# EAGLE design controlboard (EAGLE 7.5.0)
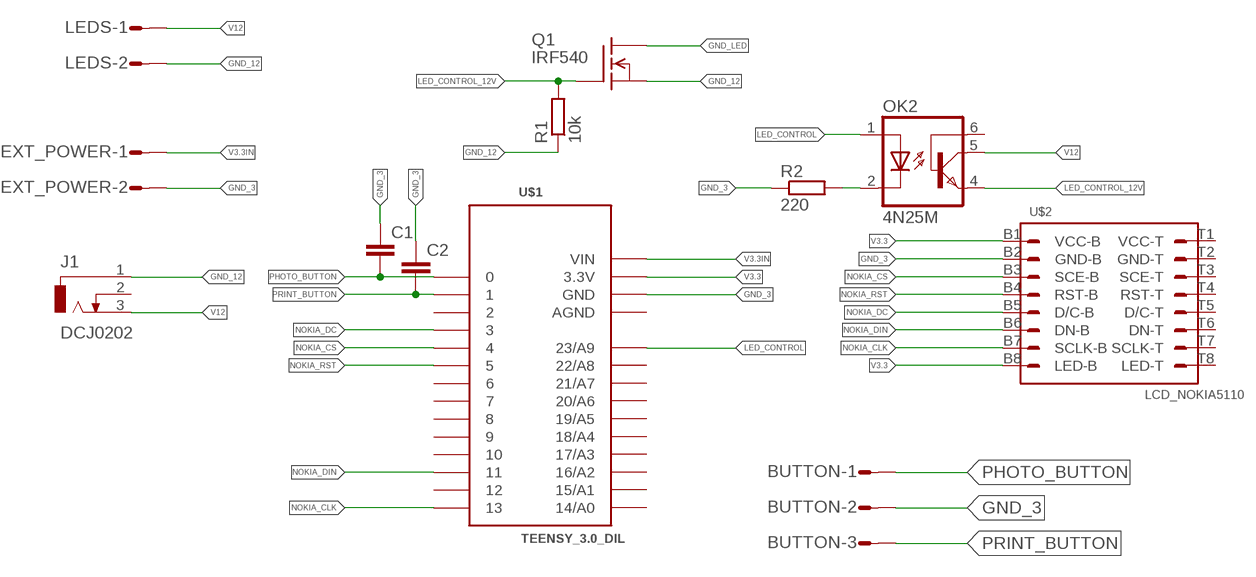
[diagram p0: schematic, sheet 1]

## Parts
BUTTON  L03P  [L03P]
C1  C-EU025-025X050  [C025-025X050]
C2  C-EU025-025X050  [C025-025X050]
EXT_POWER  S02P  [S02P]
J1  DCJ0202  [DCJ0202]
LEDS  L02P  [L02P]
OK2  4N25M  [DIL06]
Q1  IRF540  [TO220]
R1  10k  R-EU_0207/10  [0207/10]
R2  220  R-EU_0207/10  [0207/10]
U$1  TEENSY_3.0_DIL  [TEENSY3-DIL]
U$2  LCD_NOKIA5110  [NOKIA5110]

## Nets
GND_3: BUTTON.2 C1.1 C2.1 EXT_POWER.2 R2.1 U$1.GND U$2.B2(GND-B)
GND_12: J1.1 LEDS.2 Q1.3(S) R1.1
GND_LED: Q1.2(D)
LED_CONTROL: OK2.1(A) U$1.23/A9
LED_CONTROL_12V: OK2.4(EMI) Q1.1(G) R1.2
N$1: OK2.2(C) R2.2
NOKIA_CLK: U$1.13 U$2.B7(SCLK-B)
NOKIA_CS: U$1.4 U$2.B3(SCE-B)
NOKIA_DC: U$1.3 U$2.B5(D/C-B)
NOKIA_DIN: U$1.11 U$2.B6(DN-B)
NOKIA_RST: U$1.5 U$2.B4(RST-B)
PHOTO_BUTTON: BUTTON.1 C1.2 U$1.0
PRINT_BUTTON: BUTTON.3 C2.2 U$1.1
V3.3: U$1.3.3V U$2.B1(VCC-B) U$2.B8(LED-B)
V3.3IN: EXT_POWER.1 U$1.VIN
V12: J1.3 LEDS.1 OK2.5(COL)
Unconnected: J1.2 OK2.6(BAS) U$1.2 U$1.6 U$1.7 U$1.8 U$1.9 U$1.10 U$1.12 U$1.14/A0 U$1.15/A1 U$1.16/A2 U$1.17/A3 U$1.18/A4 U$1.19/A5 U$1.20/A6 U$1.21/A7 U$1.22/A8 U$2.T1(VCC-T) U$2.T2(GND-T) U$2.T3(SCE-T) U$2.T4(RST-T) U$2.T5(D/C-T) U$2.T6(DN-T) U$2.T7(SCLK-T) U$2.T8(LED-T)

## Power pins joined to a net without a drawn wire
AGND: U$1.AGND

## Library data of the parts
BUTTON = con-amp-mt:L03P: AMP MT CONNECTOR; OC_FARNELL: unknown; OC_NEWARK: unknown
C1 C2 = rcl:C-EU: CAPACITOR, European symbol
EXT_POWER = con-amp-mt:S02P: AMP MT CONNECTOR; OC_FARNELL: unknown; OC_NEWARK: unknown
J1 = con-jack:DCJ0202: DC POWER JACK Source: DCJ0202.pdf; OC_FARNELL: unknown; OC_NEWARK: unknown
LEDS = con-amp-mt:L02P: AMP MT CONNECTOR; OC_FARNELL: unknown; OC_NEWARK: unknown
OK2 = optocoupler:4N*?M: General Purpose 6-Pin Phototransistor Optocouplers Source: http://www.fairchildsemi.com/ds/4N/4N35-M.pdf; MPN: 4N25-M; OC_FARNELL: 1021349; OC_NEWARK: 98K9084
Q1 = transistor-fet:IRF540: N-Channel Enhancement MOSFET (HEXFET); 100V; 28A; 0,077Ohm
R1 = rcl:R-EU_: RESISTOR, European symbol
R2 = resistor:R-EU_: RESISTOR, European symbol
U$1 = Teensy_3_and_LC_Series_Boards_v1.1:TEENSY_3.0_DIL: TEENSY 3.0 in a classic breadboard layout - pins between the two outer rows.
U$2 = CustomLib-1.1:LCD_NOKIA5110

## Board
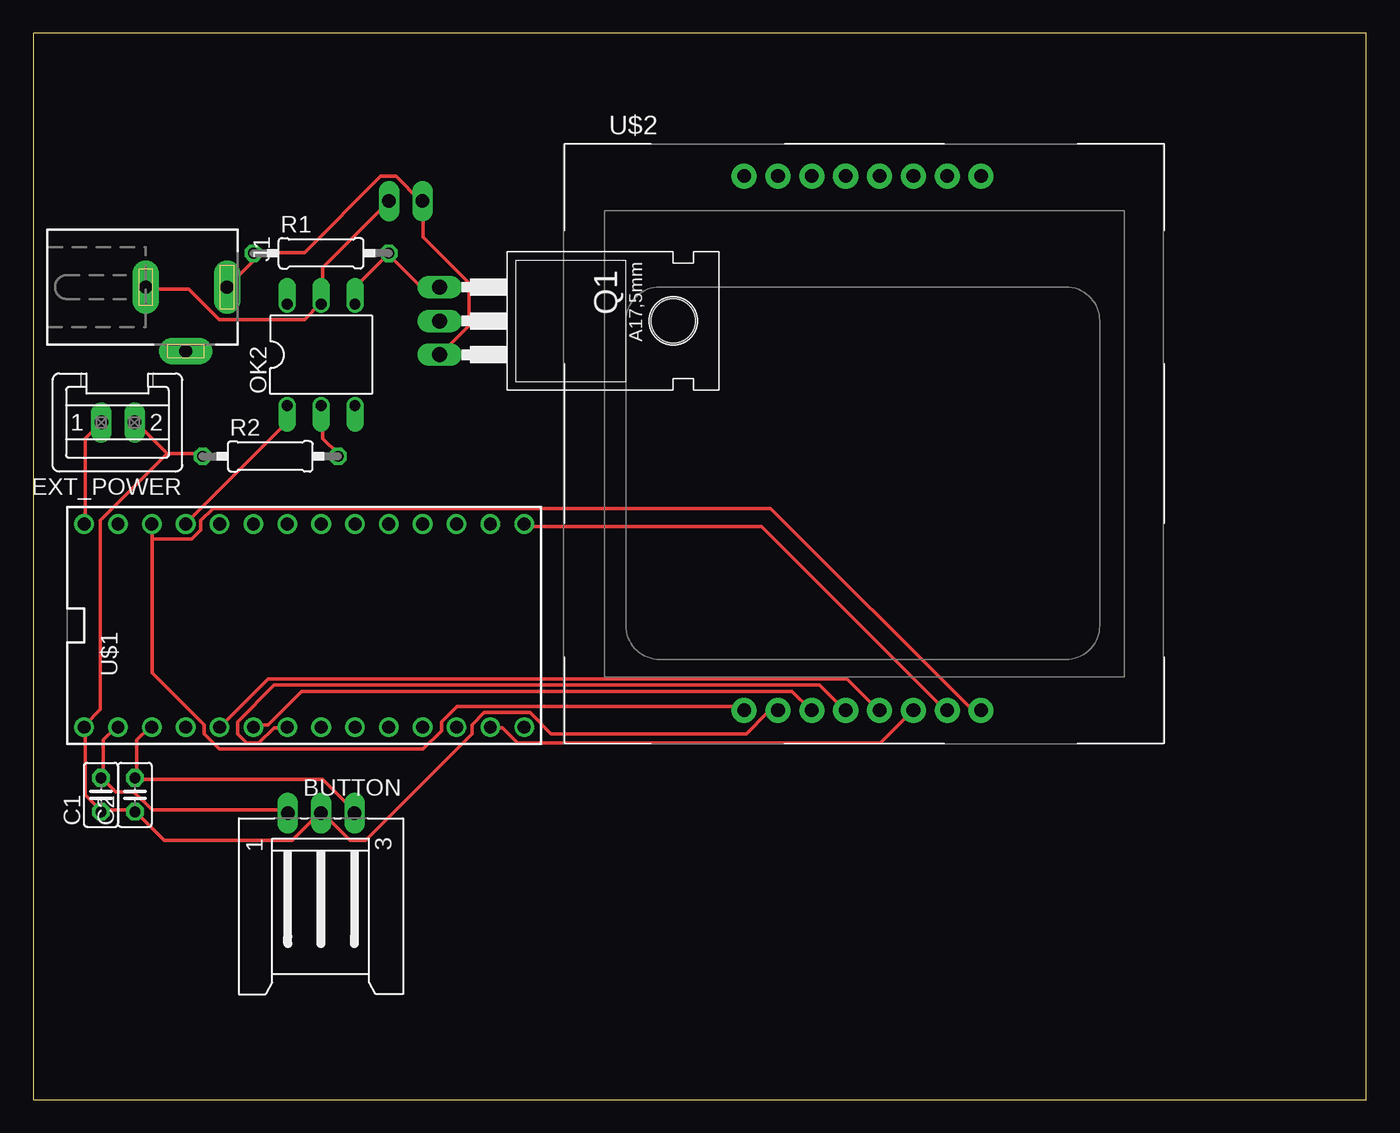
[diagram p1: board, top side]
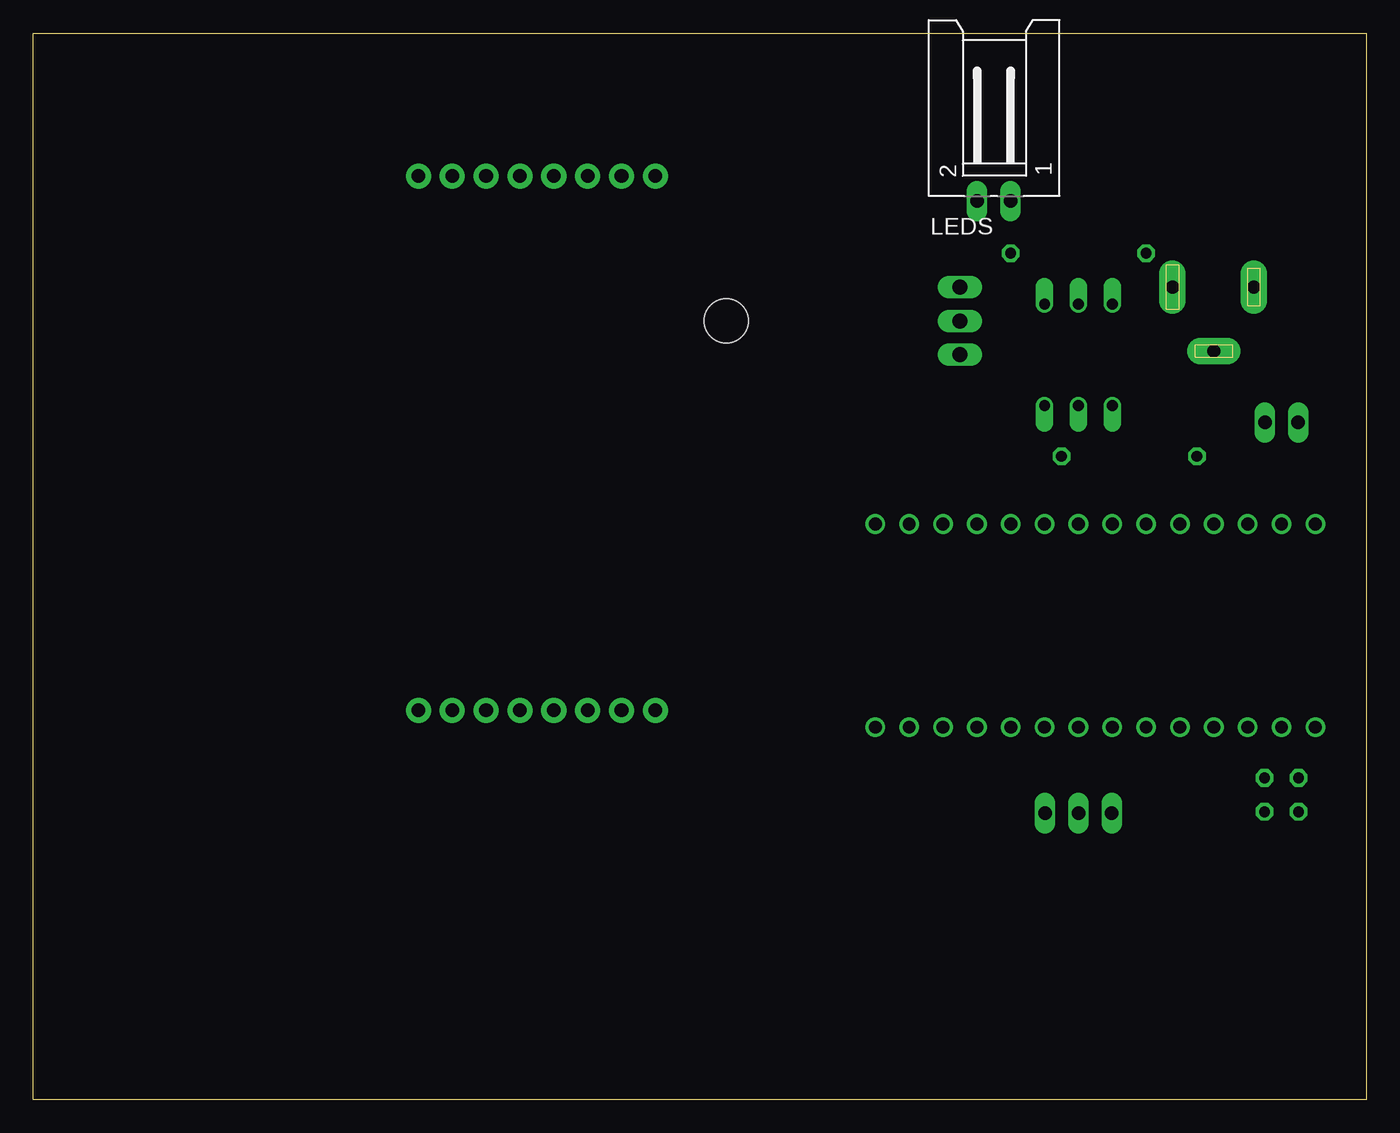
[diagram p2: board, bottom side, seen from below]

Size 100 x 80 mm. Coordinates in mm from the lower left corner, seen from the top.
Outline: 0,0 100,0 100,80 0,80 0,0
Copper layers (1*16): Top 0.035mm / dielectric 1.5mm / Bottom 0.035mm
Design rules "default": minimum track width 10mil, minimum drill 24mil, track to track 8mil, track to pad 8mil, pad to pad 8mil, via to via 8mil, smd to smd 8mil, copper to edge 40mil, drill to drill 8mil, minimum pad ring 10mil, minimum via ring 8mil, stop-mask expansion 4mil, vias tented up to drill 0mil, thermal gap 10mil

### Footprints (pad centres in the part's own frame; a part is rotated, then mirrored left to right if it is on the bottom)
L03P = drill 1.016 long: 1 2.5,-6.25; 2 0,-6.25; 3 -2.5,-6.25
C025-025X050 = drill 0.813 octagon: 1 -1.27,0; 2 1.27,0
S02P = drill 1.016 long: 1 1.25,0; 2 -1.25,0
DCJ0202 = drill 1 pad 2 long: 1 0,3.1; 2 4.8,0; 3 0,-3
L02P = drill 1.016 long: 1 1.25,-6.25; 2 -1.25,-6.25
DIL06 = drill 0.813 offset: 1 -2.54,-3.81; 2 0,-3.81; 3 2.54,-3.81; 4 2.54,3.81; 5 0,3.81; 6 -2.54,3.81
TO220 = drill 1.118 long: 1 -2.54,-6.35; 2 0,-6.35; 3 2.54,-6.35 | hole 3.302: 0,11.176
0207/10 = drill 0.813 octagon: 1 -5.08,0; 2 5.08,0
TEENSY3-DIL = drill 0.965: 0 -7.62,13.97; 1 -7.62,11.43; 2 -7.62,8.89; 3 -7.62,6.35; 3.3V 7.62,11.43; 4 -7.62,3.81; 5 -7.62,1.27; 6 -7.62,-1.27; 7 -7.62,-3.81; 8 -7.62,-6.35; 9 -7.62,-8.89; 10 -7.62,-11.43; 11 -7.62,-13.97; 12 -7.62,-16.51; 13 7.62,-16.51; 14/A0 7.62,-13.97; 15/A1 7.62,-11.43; 16/A2 7.62,-8.89; 17/A3 7.62,-6.35; 18/A4 7.62,-3.81; 19/A5 7.62,-1.27; 20/A6 7.62,1.27; 21/A7 7.62,3.81; 22/A8 7.62,6.35; 23/A9 7.62,8.89; AGND 7.62,13.97; GND -7.62,16.51; VIN 7.62,16.51
NOKIA5110 = drill 1.016 pad 1.88: B1 -0.01,0; B2 2.53,0; B3 5.07,0; B4 7.61,0; B5 10.15,0; B6 12.69,0; B7 15.23,0; B8 17.77,0; T1 -0.01,40.08; T2 2.53,40.08; T3 5.07,40.08; T4 7.61,40.08; T5 10.15,40.08; T6 12.69,40.08; T7 15.23,40.08; T8 17.77,40.08

### Placement (x,y rotation side)
BUTTON  21.59,15.24 180 top
C1  5.08,22.86 90 top
C2  7.62,22.86 90 top
EXT_POWER  6.35,50.8 180 top
J1  11.43,60.96 270 top
LEDS  27.94,73.66 0 bottom
OK2  21.59,55.88 0 top
Q1  36.83,58.42 270 top
R1  21.59,63.5 0 top
R2  17.78,48.26 0 top
U$1  20.32,35.56 90 top
U$2  53.34,29.21 0 top

### Tracks (layer width: path | path; a pad name or v marks a point on that pad's centre or on a via)
GND_3
  Top 0.254: 10.06,48.46 12.57,48.46 R2.1 | 10.06,48.46 7.77,50.75 EXT_POWER.2 | U$2.B2 55.78,29.03 55.09,29.03 53.49,27.43 38.86,27.43 37.26,29.03 33.83,29.03 32.92,28.12 32.92,27.43 24.92,19.43 23.77,19.43 21.72,21.49 BUTTON.2 21.49,21.49 19.43,19.43 9.83,19.43 7.77,21.49 C2.1 7.54,21.72 5.26,21.72 C1.1 5.03,21.72 3.89,22.86 3.89,27.89 U$1.GND 3.89,28.12 5.03,29.26 5.03,43.43 10.06,48.46
GND_12
  Top 0.254: J1.1 14.63,61.04 16.46,62.87 16.46,63.32 R1.1 16.69,63.55 20.34,63.55 26.06,69.27 27.2,69.27 29.03,67.44 LEDS.2 29.26,67.21 29.26,64.69 32.69,61.27 32.69,58.06 30.63,56.01 Q1.3
LED_CONTROL
  Top 0.254: OK2.1 18.97,51.89 18.97,50.75 11.43,43.2 U$1.23/A9
LED_CONTROL_12V
  Top 0.254: OK2.4 24.23,59.89 24.23,61.04 26.52,63.32 R1.2 26.75,63.32 29.03,61.04 30.4,61.04 Q1.1
N$1
  Top 0.254: OK2.2 21.72,51.89 21.72,49.61 22.86,48.46 R2.2
NOKIA_CLK
  Top 0.254: U$1.13 37.03,42.98 54.63,42.98 68.35,29.26 U$2.B7
NOKIA_CS
  Top 0.254: U$1.4 16.69,28.12 17.6,28.12 20.12,30.63 56.92,30.63 58.29,29.26 U$2.B3
NOKIA_DC
  Top 0.254: U$1.3 14.17,28.12 17.6,31.55 61.04,31.55 63.32,29.26 U$2.B5
NOKIA_DIN
  Top 0.254: U$1.11 34.29,27.89 35.2,27.89 36.35,26.75 63.55,26.75 65.84,29.03 U$2.B6
NOKIA_RST
  Top 0.254: U$1.5 18.97,27.89 18.06,27.89 16.92,26.75 16,26.75 15.32,27.43 15.32,28.35 18.06,31.09 58.98,31.09 60.81,29.26 U$2.B4
PHOTO_BUTTON
  Top 0.254: U$1.0 6.17,27.89 5.26,26.98 5.26,24.23 C1.2 5.26,24 6.17,23.09 7.54,23.09 8.91,21.72 18.97,21.72 BUTTON.1
PRINT_BUTTON
  Top 0.254: U$1.1 8.69,27.89 7.77,26.98 7.77,24.23 C2.2 7.77,24 21.72,24 24,21.72 BUTTON.3
V3.3
  Top 0.254: 8.91,42.06 8.91,32 12.8,28.12 12.8,27.43 13.95,26.29 29.26,26.29 30.63,27.66 30.63,28.35 31.77,29.49 53.03,29.49 53.26,29.26 U$2.B1 | 8.91,42.06 8.91,42.98 U$1.3.3V | 8.91,42.06 11.89,42.06 12.57,42.75 12.57,43.43 13.49,44.35 55.32,44.35 70.41,29.26 71.09,29.26 U$2.B8
V3.3IN
  Top 0.254: U$1.VIN 3.89,43.2 3.89,49.61 5.03,50.75 EXT_POWER.1
V12
  Top 0.254: LEDS.1 26.52,67.21 21.72,62.41 21.72,59.89 OK2.5 21.49,59.66 20.34,58.52 13.95,58.52 11.66,60.81 8.46,60.81 J1.3